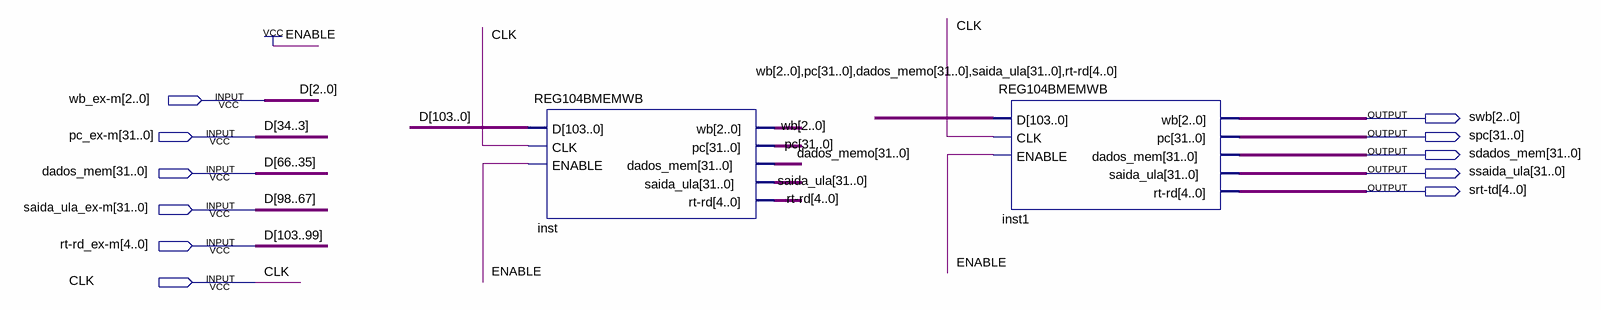
[diagram p0: schematic sheet]
// Quartus schematic MEM-WB.bdf as structural Verilog: 2 symbols, 11 pins
module \MEM-WB  (
  input  [2:0] \wb_ex-m ,
  input  [31:0] \pc_ex-m ,
  input  [31:0] dados_mem,
  input  [31:0] \saida_ula_ex-m ,
  input  [4:0] \rt-rd_ex-m ,
  input  CLK,
  output [2:0] swb,
  output [31:0] spc,
  output [31:0] sdados_mem,
  output [31:0] ssaida_ula,
  output [4:0] \srt-td 
);

  wire [2:0] wb;
  wire [4:0] \rt-rd ;
  wire [31:0] dados_memo, pc, saida_ula;

  REG104BMEMWB inst (
    .D({\rt-rd_ex-m , \saida_ula_ex-m , dados_mem, \pc_ex-m , \wb_ex-m }), .CLK(CLK), .ENABLE(1'b1), .wb(wb),
    .pc(pc), .dados_mem(dados_memo), .saida_ula(saida_ula), .\rt-rd (\rt-rd ));
  REG104BMEMWB inst1 (
    .D({wb, pc, dados_memo, saida_ula, \rt-rd }), .CLK(CLK), .ENABLE(1'b1), .wb(swb), .pc(spc),
    .dados_mem(sdados_mem), .saida_ula(ssaida_ula), .\rt-rd (\srt-td ));

  // Other names for the same wires on the sheet: D[103:0] = {\rt-rd_ex-m , \saida_ula_ex-m , dados_mem, \pc_ex-m , \wb_ex-m }
endmodule
